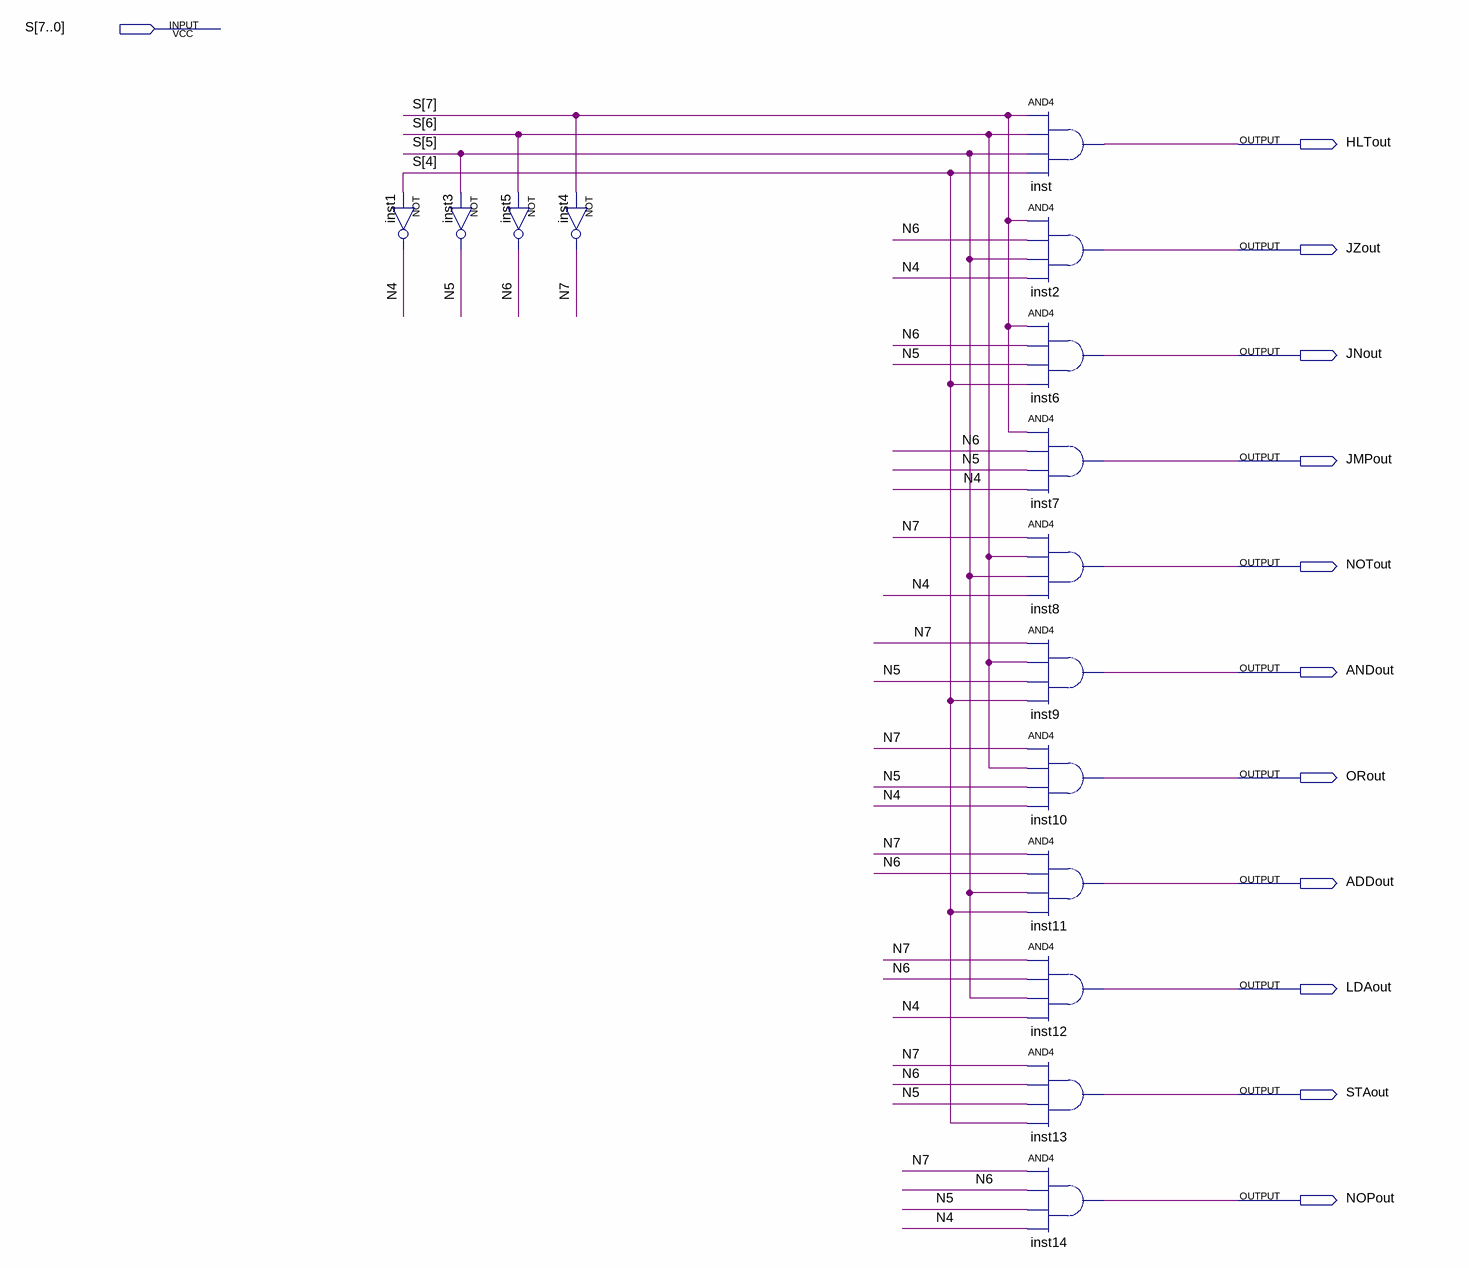
[diagram p0: schematic sheet]
// Quartus schematic DECODER.bdf as structural Verilog: 15 symbols, 12 pins
module DECODER (
  input  [7:0] S,
  output HLTout,
  output JZout,
  output JNout,
  output JMPout,
  output NOTout,
  output ANDout,
  output ORout,
  output ADDout,
  output LDAout,
  output STAout,
  output NOPout
);

  wire N4, N5, N6, N7;

  not inst1 (N4, S[4]);
  not inst3 (N5, S[5]);
  not inst5 (N6, S[6]);
  not inst4 (N7, S[7]);
  and inst (HLTout, S[7], S[6], S[5], S[4]);
  and inst2 (JZout, S[7], N6, S[5], N4);
  and inst6 (JNout, S[7], N6, N5, S[4]);
  and inst7 (JMPout, S[7], N6, N5, N4);
  and inst8 (NOTout, N7, S[6], S[5], N4);
  and inst9 (ANDout, N7, S[6], N5, S[4]);
  and inst10 (ORout, N7, S[6], N5, N4);
  and inst11 (ADDout, N7, N6, S[5], S[4]);
  and inst12 (LDAout, N7, N6, S[5], N4);
  and inst13 (STAout, N7, N6, N5, S[4]);
  and inst14 (NOPout, N7, N6, N5, N4);
endmodule
